# Altium schematic sheet PLD_CAM_MUX.SchDoc: CAMs UART-Buffer
size A4; SheetTotal: 32
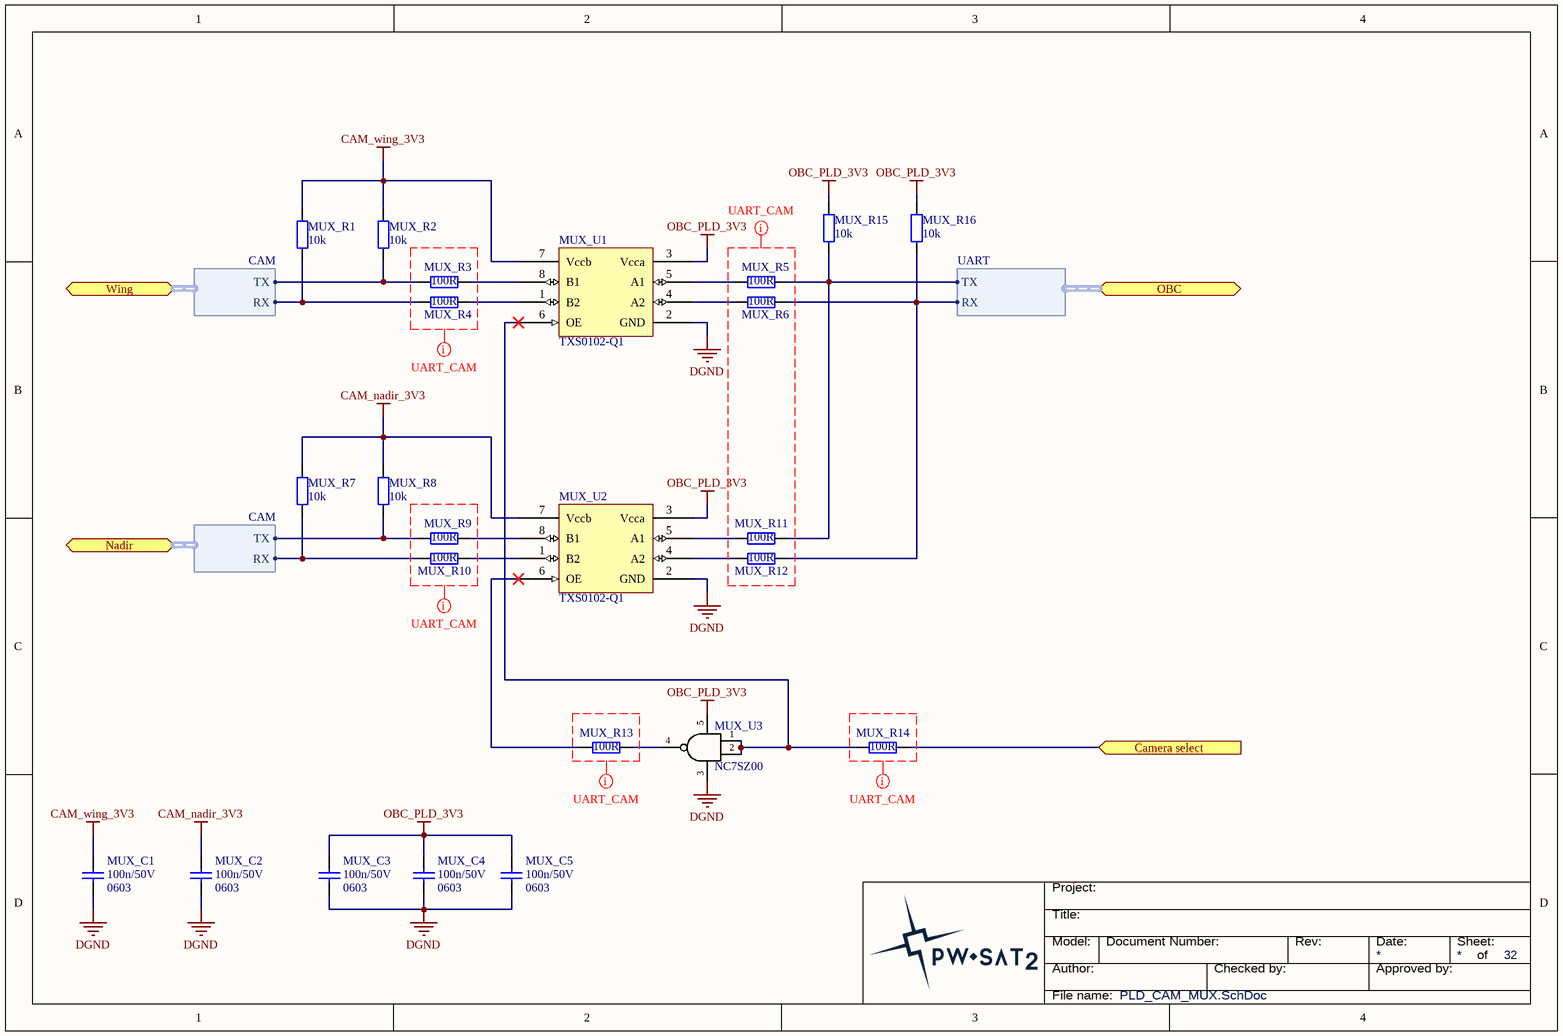
[diagram p0: PLD_CAM_MUX.SchDoc]

## Parts
MUX_C1  Package: 0603  [SMD_Capacitor_0603]  (hidden comment: 100n/50V)
MUX_C2  Package: 0603  [SMD_Capacitor_0603]  (hidden comment: 100n/50V)
MUX_C3  Package: 0603  [SMD_Capacitor_0603]  (hidden comment: 100n/50V)
MUX_C4  Package: 0603  [SMD_Capacitor_0603]  (hidden comment: 100n/50V)
MUX_C5  Package: 0603  [SMD_Capacitor_0603]  (hidden comment: 100n/50V)
MUX_R1  10k  [SMD_Resistor_0603]
MUX_R2  10k  [SMD_Resistor_0603]
MUX_R3  100R  [SMD_Resistor_0603]
MUX_R4  100R  [SMD_Resistor_0603]
MUX_R5  100R  [SMD_Resistor_0603]
MUX_R6  100R  [SMD_Resistor_0603]
MUX_R7  10k  [SMD_Resistor_0603]
MUX_R8  10k  [SMD_Resistor_0603]
MUX_R9  100R  [SMD_Resistor_0603]
MUX_R10  100R  [SMD_Resistor_0603]
MUX_R11  100R  [SMD_Resistor_0603]
MUX_R12  100R  [SMD_Resistor_0603]
MUX_R13  100R  [SMD_Resistor_0603]
MUX_R14  100R  [SMD_Resistor_0603]
MUX_R15  10k  [SMD_Resistor_0603]
MUX_R16  10k  [SMD_Resistor_0603]
MUX_U1  TXS0102-Q1  [VSSOP-8]
MUX_U2  TXS0102-Q1  [VSSOP-8]
MUX_U3  NC7SZ00  [SOT23-5]

## Ports
Camera select (in), Nadir (harness CAM), OBC (harness UART), Wing (harness CAM)

## Harnesses
UART: RX, TX
CAM: TX, RX

## Nets
CAM_nadir_3V3: MUX_C2.1 MUX_R7.1 MUX_R8.1 MUX_U2.7(Vccb)
CAM_wing_3V3: MUX_C1.1 MUX_R1.2 MUX_R2.2 MUX_U1.7(Vccb)
DGND: MUX_C1.2 MUX_C2.2 MUX_C3.2 MUX_C4.2 MUX_C5.2 MUX_U1.2(GND) MUX_U2.2(GND) MUX_U3.3(GND)
OBC_PLD_3V3: MUX_C3.1 MUX_C4.1 MUX_C5.1 MUX_R15.2 MUX_R16.2 MUX_U1.3(Vcca) MUX_U2.3(Vcca) MUX_U3.5(Vcc)
Camera select: MUX_R14.2 ; port Camera select
NetMUX_R1_1: MUX_R1.1 MUX_R4.2 ; port Wing.RX
NetMUX_R2_1: MUX_R2.1 MUX_R3.2 ; port Wing.TX
NetMUX_R3_1: MUX_R3.1 MUX_U1.8(B1)
NetMUX_R4_1: MUX_R4.1 MUX_U1.1(B2)
NetMUX_R5_1: MUX_R5.1 MUX_R11.2 MUX_R15.1 ; port OBC.TX
NetMUX_R5_2: MUX_R5.2 MUX_U1.5(A1)
NetMUX_R6_1: MUX_R6.1 MUX_R12.2 MUX_R16.1 ; port OBC.RX
NetMUX_R6_2: MUX_R6.2 MUX_U1.4(A2)
NetMUX_R7_2: MUX_R7.2 MUX_R10.1 ; port Nadir.RX
NetMUX_R8_2: MUX_R8.2 MUX_R9.1 ; port Nadir.TX
NetMUX_R9_2: MUX_R9.2 MUX_U2.8(B1)
NetMUX_R10_2: MUX_R10.2 MUX_U2.1(B2)
NetMUX_R11_1: MUX_R11.1 MUX_U2.5(A1)
NetMUX_R12_1: MUX_R12.1 MUX_U2.4(A2)
NetMUX_R13_1: MUX_R13.1 MUX_U2.6(OE)
NetMUX_R13_2: MUX_R13.2 MUX_U3.4(Y)
NetMUX_R14_1: MUX_R14.1 MUX_U1.6(OE) MUX_U3.1(A) MUX_U3.2(B)

## Layout directives
net class UART_CAM: (no net found under the mark)

## Notes on the sheet
- Title:
- Project:
- Author:
- Model:
- Document Number:
- Checked by:
- Rev:
- Date:
- Approved by:
- Sheet:
- of
- File name:

## Library data of the parts
MUX_C1-MUX_C5 = Cer_C0603T104K5RALTU: Ceramic Cap Kemet COTS 100n/50V X7R 0603; Manufacturer: Kemet; ManufacturerPartNumber: C0603T104K5RALTU; Value: 100n/50V
MUX_R1-MUX_R16 = Res
  MUX_R1 MUX_R2: Value: 10k; Package: 0603
  MUX_R3-MUX_R6 MUX_R9-MUX_R14: Value: 100R
  MUX_R7 MUX_R8 MUX_R15 MUX_R16: Value: 10k
MUX_U1 MUX_U2 = TXS0102-Q1: 2-Bit Bidirectional Voltage-Level Translator  for Open-Drain and Push-Pull Applications; Manufacturer: Texas Instruments; Value: TXS0102-Q1; ComponentLink1URL: http://www.ti.com/lit/ds/symlink/txs0102-q1.pdf; ComponentLink1Description: Description; HelpURL: http://www.ti.com/lit/ds/symlink/txs0102-q1.pdf
MUX_U3 = NC7SZ00: TinyLogic UHS Two-Input NAND Gate.; Manufacturer: Fairchild Semiconductor; Value: NC7SZ00